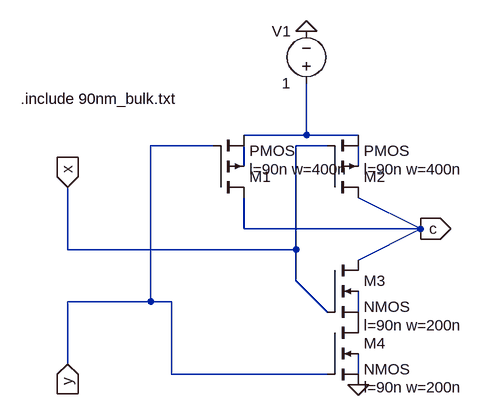
[diagram p0: schematic nand.asc]
nand.asc, the LTspice schematic file:
Version 4
SHEET 1 880 680
WIRE 176 16 176 -64
WIRE 176 16 80 16
WIRE 256 16 176 16
WIRE 32 32 -64 32
WIRE 208 32 160 32
WIRE 80 64 80 32
WIRE 256 64 256 32
WIRE 80 160 80 112
WIRE 352 160 256 112
WIRE 352 160 80 160
WIRE -192 192 -192 96
WIRE 160 192 160 32
WIRE 160 192 -192 192
WIRE 256 208 352 160
WIRE 160 240 160 192
WIRE -64 272 -64 32
WIRE -64 272 -192 272
WIRE -32 272 -64 272
WIRE 208 288 160 240
WIRE 256 288 256 256
WIRE -192 368 -192 272
WIRE -32 384 -32 272
WIRE 208 384 -32 384
WIRE 256 384 256 352
FLAG 256 400 0
FLAG 176 -144 0
FLAG -192 96 x
IOPIN -192 96 In
FLAG -192 368 y
IOPIN -192 368 In
FLAG 352 160 c
IOPIN 352 160 Out
SYMBOL pmos4 32 112 M180
WINDOW 123 56 44 Left 2
SYMATTR Value2 l=90n w=400n
SYMATTR InstName M1
SYMBOL pmos4 208 112 M180
WINDOW 123 56 44 Left 2
SYMATTR Value2 l=90n w=400n
SYMATTR InstName M2
SYMBOL nmos4 208 208 R0
WINDOW 123 56 100 Left 2
SYMATTR Value2 l=90n w=200n
SYMATTR InstName M3
SYMBOL nmos4 208 304 R0
WINDOW 123 56 100 Left 2
SYMATTR Value2 l=90n w=200n
SYMATTR InstName M4
SYMBOL voltage 176 -48 R180
WINDOW 0 24 96 Left 2
WINDOW 3 24 16 Left 2
WINDOW 123 0 0 Left 0
WINDOW 39 0 0 Left 0
SYMATTR InstName V1
SYMATTR Value 1
TEXT -264 -40 Left 2 !.include 90nm_bulk.txt

The netlist it stands for:
* nand.asc
M1 c y N001 N002 PMOS l=90n w=400n
M2 c x N001 N003 PMOS l=90n w=400n
M3 c x P001 N004 NMOS l=90n w=200n
M4 P001 y 0 N005 NMOS l=90n w=200n
V1 N001 0 1
.model NMOS NMOS
.model PMOS PMOS
.lib standard.mos
.include 90nm_bulk.txt
.backanno
.end